# EAGLE design Shutter Sensors (EAGLE 9.0.1)
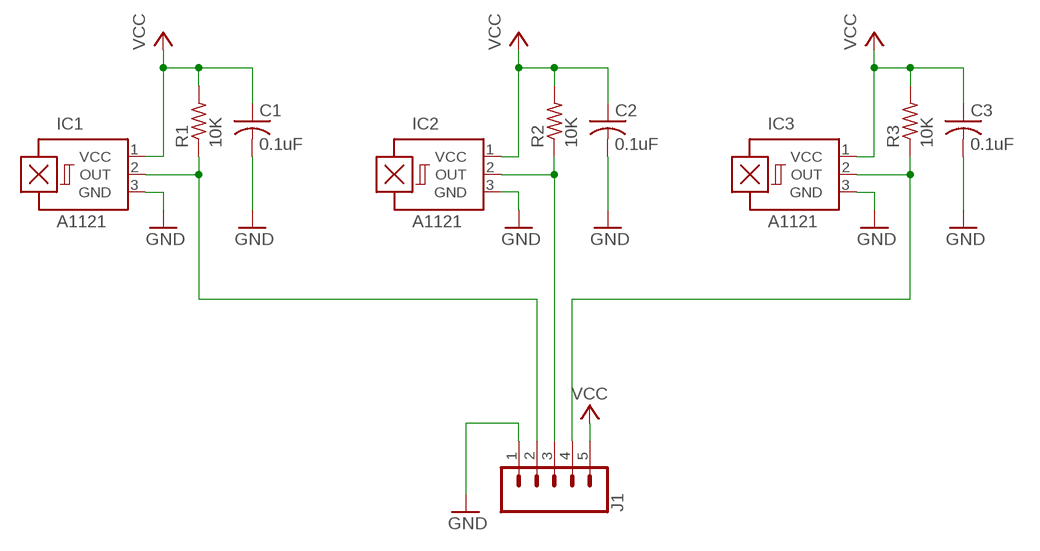
[diagram p0: schematic, sheet 1]

## Parts
C1  0.1uF  C-USC0805  [C0805]
C2  0.1uF  C-USC0805  [C0805]
C3  0.1uF  C-USC0805  [C0805]
IC1  A1121  A12ALLEGRO-HALL  [SOT95P285X113-3]
IC2  A1121  A12ALLEGRO-HALL  [SOT95P285X113-3]
IC3  A1121  A12ALLEGRO-HALL  [SOT95P285X113-3]
J1  CONN_051X05-0.1-RA  [1X05/90]
R1  10K  R-US_R0805  [R0805]
R2  10K  R-US_R0805  [R0805]
R3  10K  R-US_R0805  [R0805]

## Nets
GND: C1.2 C2.2 C3.2 IC1.3(GND) IC2.3(GND) IC3.3(GND) J1.1
N$1: IC2.2(OUT) J1.3 R2.1
N$2: IC1.2(OUT) J1.2 R1.1
N$9: IC3.2(OUT) J1.4 R3.1
VCC: C1.1 C2.1 C3.1 IC1.1(VCC) IC2.1(VCC) IC3.1(VCC) J1.5 R1.2 R2.2 R3.2

## Library data of the parts
C1-C3 = AUmlib:C-US: CAPACITOR, American symbol; SPICEPREFIX: C
IC1-IC3 = AUmlib:A12*?: Hall-effect bipolar switch Source: http://www.allegromicro.com/en/Products/Part_Numbers/1202/1202.pdf
J1 = AUmlib:CONN_05: Multi connection point. Often used as Generic Header-pin footprint for 0.1 inch spaced/style header connections On any of the 0.1 inch spaced packages, you can populate with these: Break Away Headers - Straight <https://www.sparkfun.com/products/116> (PRT-00116) Break Away Male Headers - Right Angle <https://www.sparkfun.com/products/553> (PRT-00553) Female Headers <https://www.sparkfun.com/products/115> (PRT-00115) Break Away Headers - Machine Pin <https://www.sparkfun.com/products/117> (PRT-00117) Break Away Female Headers - Swiss Machine Pin <https://www.sparkfun.com/products/743> (PRT-00743) For SCREWTERMINALS and SPRING TERMINALS visit here: Screw Terimnals on SparkFun.com <https://www.sparkfun.com/search/results?term=Screw+Terminals> (5mm/3.5mm/2.54mm spacing) This device is also useful as a general connection point to wire up your design to another part of your project. Our various solder wires solder well into these plated through hole pads. Hook-Up Wire - Assortment (Stranded, 22 AWG) <https://www.sparkfun.com/products/11375> (PRT-11375) Hook-Up Wire - Assortment (Solid Core, 22 AWG) <https://www.sparkfun.com/products/11367> (PRT-11367) View the entire wire category on our website here <https://www.sparkfun.com/categories/141> Special notes: Molex polarized connector foot print use with SKU : PRT-08231 with associated crimp pins and housings. 1MM SMD Version SKU: PRT-10208
R1-R3 = AUmlib:R-US_: RESISTOR, American symbol; SPICEPREFIX: R

## Net classes
1 std: width 0.3 mm, drill 0.35 mm, clearance 0.3 mm

## Board
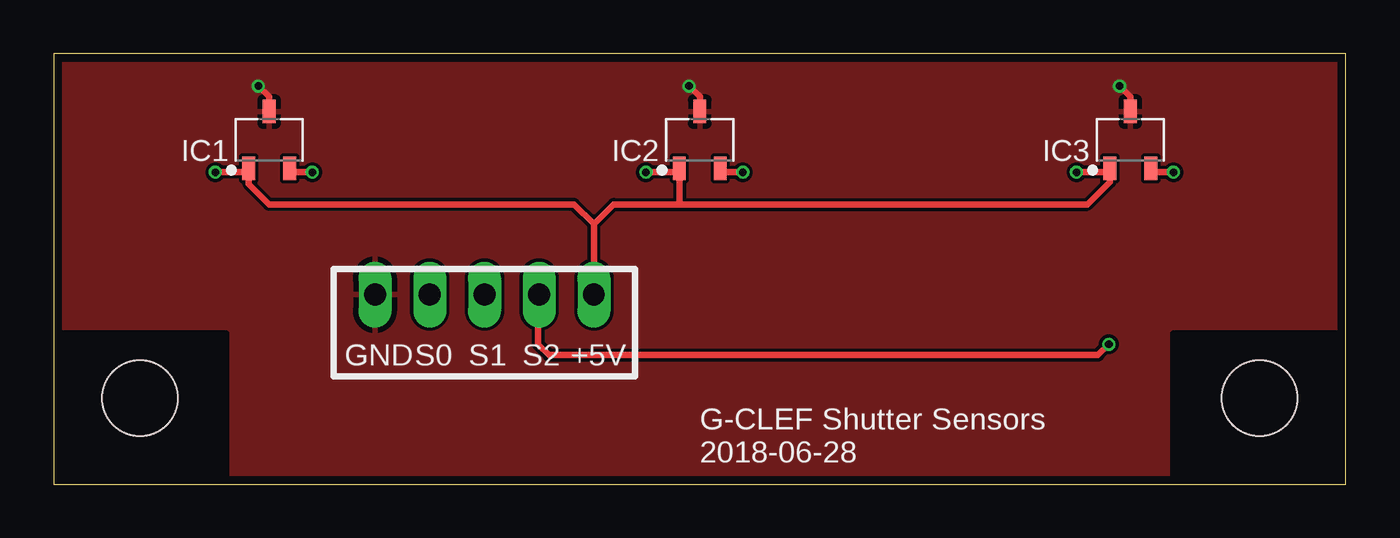
[diagram p1: board, top side]
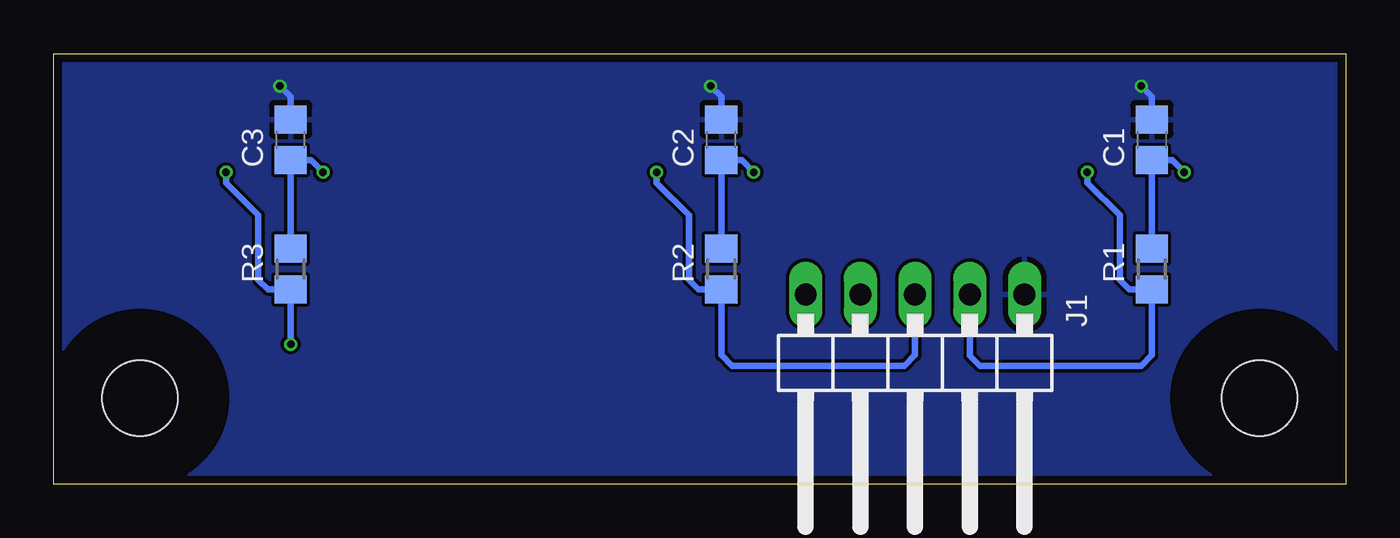
[diagram p2: board, bottom side, seen from below]

Size 60 x 20 mm. Coordinates in mm from the lower left corner, seen from the top.
Outline: 0,0 60,0 60,20 0,20 0,0
Copper layers (1*16): Top 0.035559375mm / dielectric 1.6mm / Bottom 0.035559375mm
Design rules "oshpark-2layer": minimum track width 6mil, minimum drill 10mil, track to track 6mil, track to pad 6mil, pad to pad 6mil, via to via 6mil, smd to smd 6mil, copper to edge 15mil, drill to drill 6mil, minimum pad ring 5mil, minimum via ring 5mil, stop-mask expansion 2.5mil, vias tented up to drill 0mil, thermal gap 10mil
Holes 3.5 mm at 4,4 56,4
tRestrict: 8 lines
bRestrict: area 0,0 to 8,8; area 52,0 to 60,8

### Footprints (pad centres in the part's own frame; a part is rotated, then mirrored left to right if it is on the bottom)
C0805 = smd 1.3 x 1.5: 1 -0.95,0; 2 0.95,0
SOT95P285X113-3 = smd 1.083 x 0.589: 1 -1.319,0.95; 2 -1.319,-0.95; 3 1.319,0
1X05/90 = drill 1.016 long: 1 -5.08,-3.81; 2 -2.54,-3.81; 3 0,-3.81; 4 2.54,-3.81; 5 5.08,-3.81
R0805 = smd 1.3 x 1.5: 1 -0.95,0; 2 0.95,0

### Placement (x,y rotation side)
C1  9,16 90 bottom
C2  29,16 90 bottom
C3  49,16 90 bottom
IC1  10,16 90 top
IC2  30,16 90 top
IC3  50,16 90 top
J1  20,5 180 bottom
R1  9,10 90 bottom
R2  29,10 90 bottom
R3  49,10 90 bottom

### Tracks (layer width: path | path; a pad name or v marks a point on that pad's centre or on a via)
GND  (via drill 0.35)
  Top 0.305: IC1.3 10,18 v9.5,18.5 | IC2.3 30,18 v29.5,18.5 | IC3.3 50,18 v49.5,18.5
  Bottom 0.305: v9.5,18.5 9,18 C1.2 | v29.5,18.5 29,18 C2.2 | v49.5,18.5 49,18 C3.2
  pour Bottom: 0,0 0,20 60,20 60,0
  pour Top: 0,0 0,20 60,20 60,0
N$1  (via drill 0.35)
  Top 0.305: IC2.2 31.13,14.5 v32,14.5
  Bottom 0.305: v32,14.5 32,14 30.5,12.5 30.5,9.5 30.05,9.05 R2.1 29,6 28.5,5.5 20.5,5.5 20,6 J1.3
N$2  (via drill 0.35)
  Top 0.305: IC1.2 11.13,14.5 v12,14.5
  Bottom 0.305: v12,14.5 12,14 10.5,12.5 10.5,9.5 10.05,9.05 R1.1 9,6 9.5,5.5 17,5.5 17.46,5.96 J1.2
N$9  (via drill 0.35)
  Top 0.305: IC3.2 51.13,14.5 v52,14.5 | J1.4 22.5,8.77 22.5,6.5 23,6 48.5,6 v49,6.5
  Bottom 0.305: v52,14.5 52,14 50.5,12.5 50.5,9.5 50.05,9.05 R3.1 v49,6.5
VCC  (via drill 0.35)
  Top 0.305: J1.5 25.08,12.08 | 25.08,12.08 26,13 29,13 | 29,13 48,13 49.05,14.05 IC3.1 48.87,14.5 v47.5,14.5 | 29,13 29.05,13.05 IC2.1 28.87,14.5 v27.5,14.5 | 25.08,12.08 24.16,13 10,13 9.05,13.95 IC1.1 8.87,14.5 v7.5,14.5
  Bottom 0.305: R3.2 C3.1 48.05,15.05 v47.5,14.5 | R2.2 C2.1 28.05,15.05 v27.5,14.5 | R1.2 C1.1 8.05,15.05 v7.5,14.5

### Text on the board
tPlace: GND | S0 | S1 | S2 | +5V | G-CLEF Shutter Sensors / 2018-06-28